# EAGLE board Audio-DAC (EAGLE 9.6.2), part 1 of 2
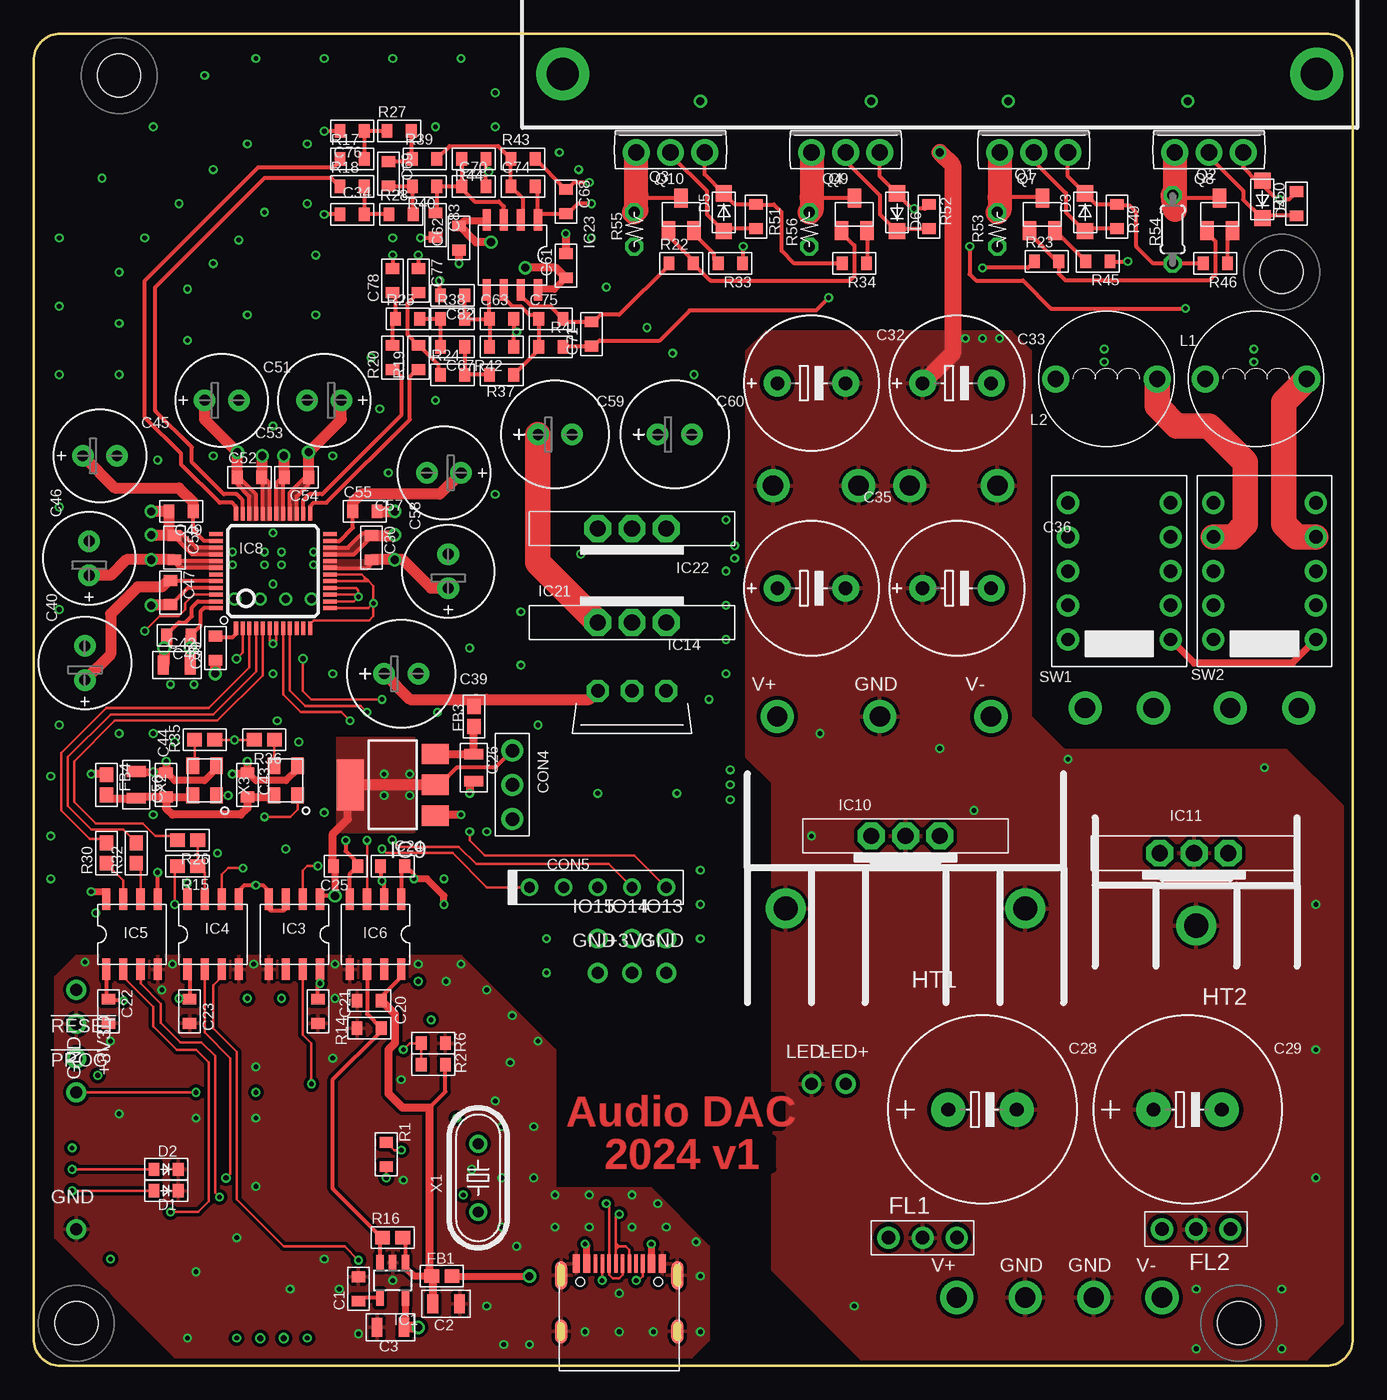
[diagram p3: board, top side]
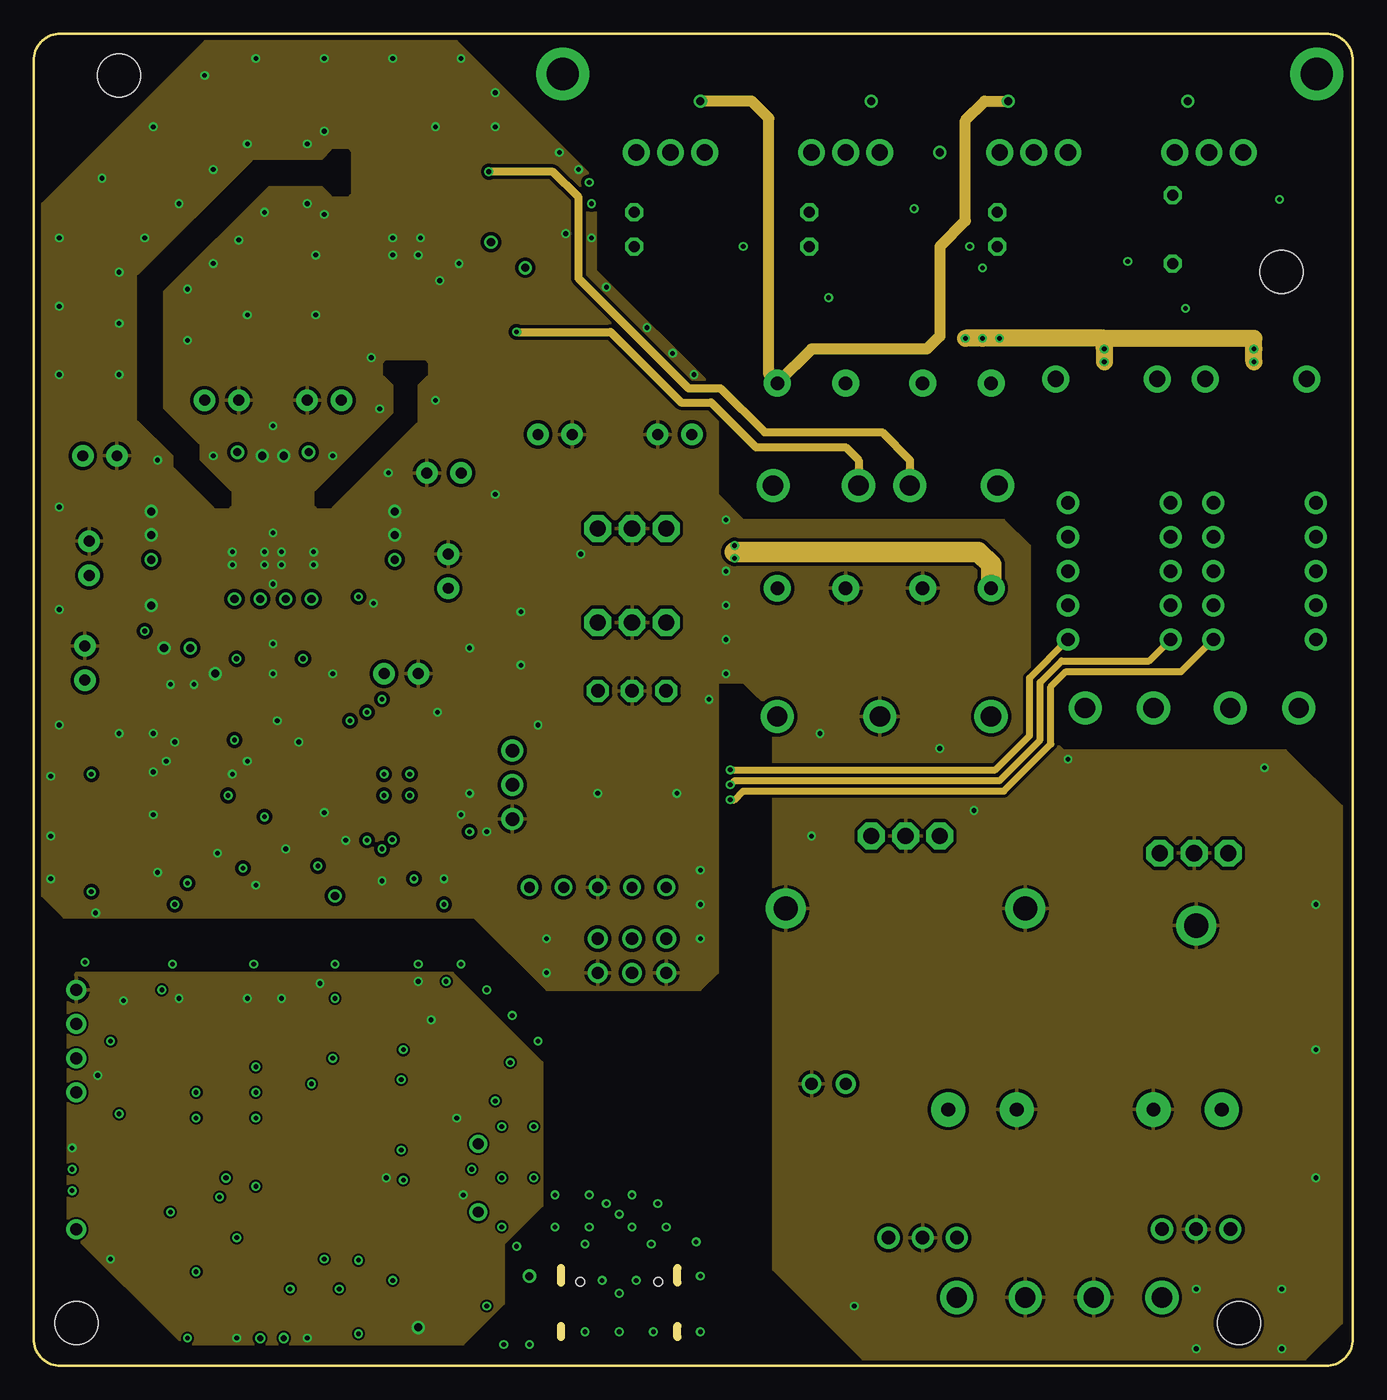
[diagram p4: board, inner layer Route2]
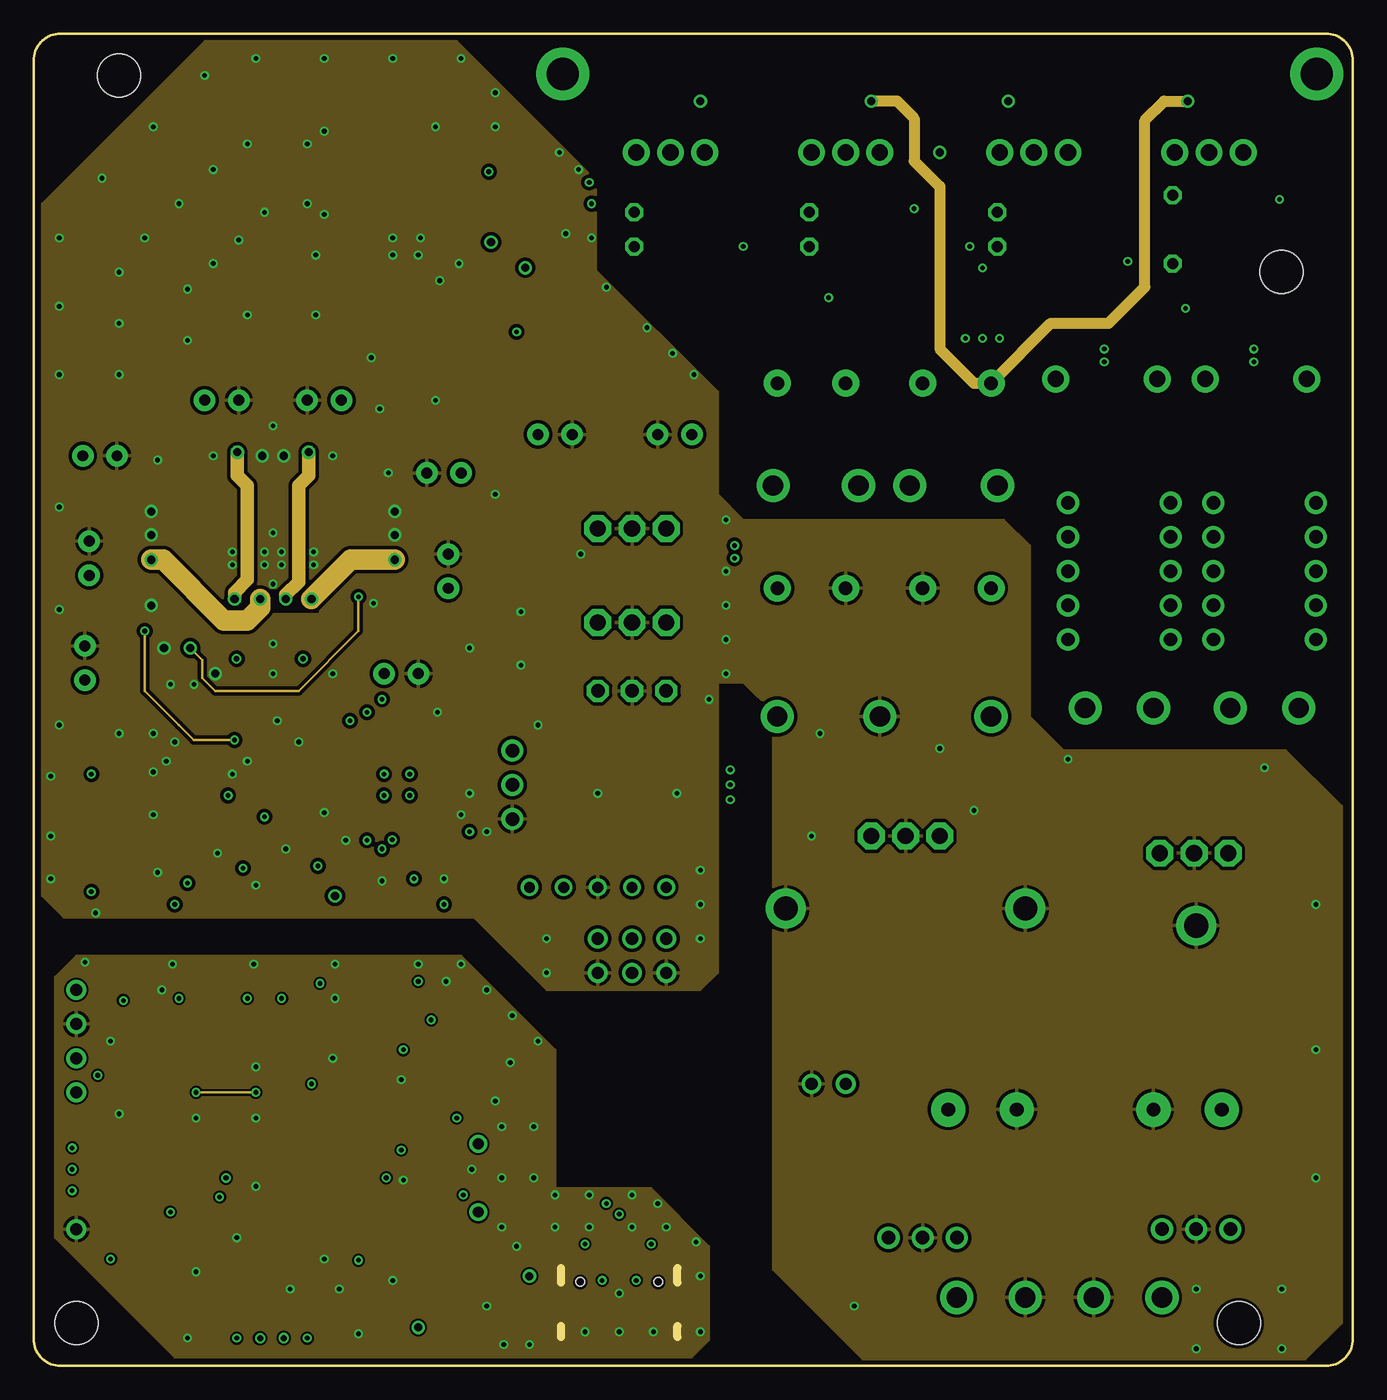
[diagram p5: board, inner layer Route15]
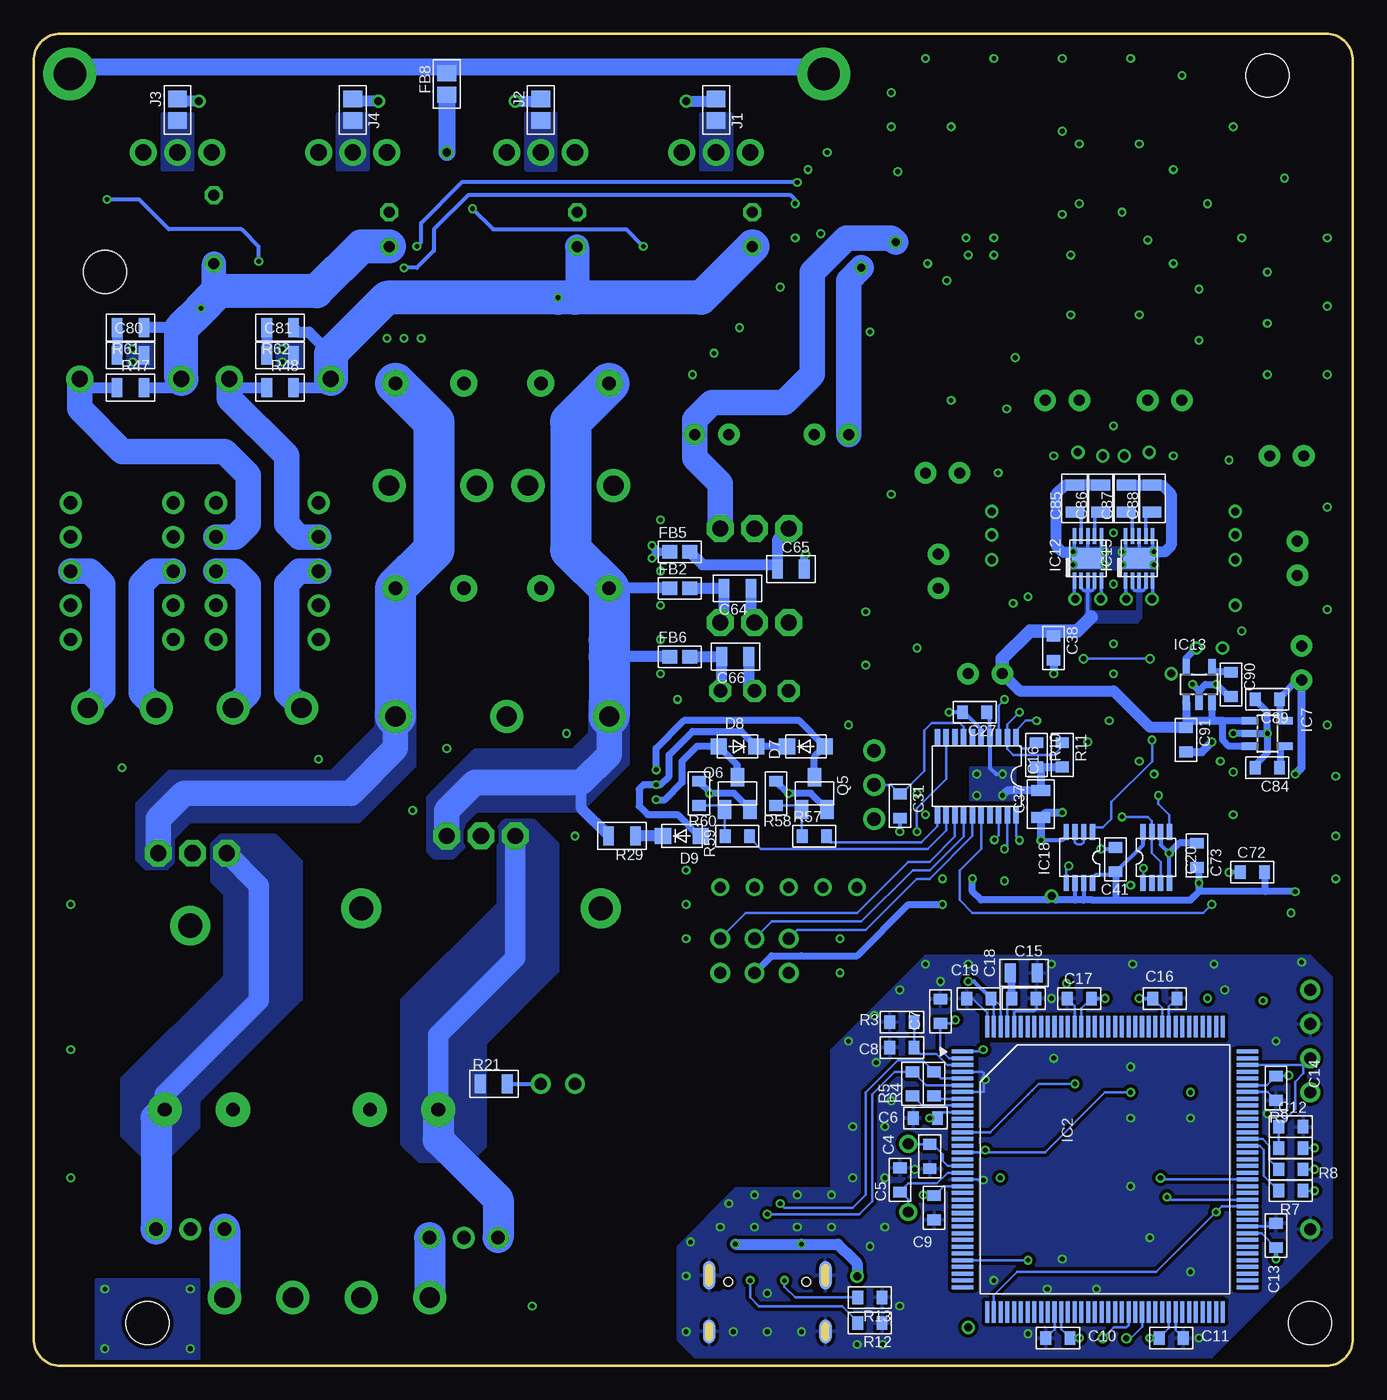
[diagram p6: board, bottom side, seen from below]

Size 98 x 99 mm. Coordinates in mm from the lower left corner, seen from the top.
Outline: 2,0 96,0 arc90 98,2 98,97 arc90 96,99 2,99 arc90 0,97 0,2 arc90 2,0
Copper layers (1*2*15*16): Top 0.035mm / dielectric 0.2mm / Route2 0.0175mm / dielectric 1.065mm / Route15 0.0175mm / dielectric 0.2mm / Bottom 0.035mm
Design rules "JLCPCB_4layer *": minimum track width 6mil, minimum drill 0.3mm, track to track 6mil, track to pad 6mil, pad to pad 6mil, via to via 8mil, smd to smd 0mil, copper to edge 0.2mm, drill to drill 0.4mm, minimum pad ring 8mil, minimum via ring 6mil, stop-mask expansion 4mil, vias tented up to drill 1mm, thermal gap 10mil
tRestrict: 4 lines
bRestrict: 16 lines

## Footprints (pad centres in the part's own frame; a part is rotated, then mirrored left to right if it is on the bottom)
1608C = smd 0.8 x 1: 1 -0.9,0; 2 0.9,0
2012 = smd 0.8 x 1.4: 1 -1,0; 2 1,0
E5-13 = drill 1.016 pad 2.54: + -2.54,0; - 2.54,0
E5-10 = drill 1 pad 2: + -2.54,0; - 2.54,0
E2,5-8 = drill 0.813 pad 1.6: + -1.27,0; - 1.27,0
E2.5-6.5 = drill 0.813 pad 1.6: + -1.27,0; - 1.27,0
5077CR-16-SMC2-BK-TR = smd 0.6 x 1.34: A1,B12:GND -3.2,0.3; A4,B9:VBUS -2.4,0.3; B1,A12:GND 3.2,0.3; B4,A9:VBUS 2.4,0.3 | smd 0.3 x 1.34: A5:CC1 -1.25,0.3; A6:DP1 -0.25,0.3; A7:DN1 0.25,0.3; A8:SBU1 1.25,0.3; B5:CC2 1.75,0.3; B6:DP2 0.75,0.3; B7:DN2 -0.75,0.3; B8:SBU2 -1.75,0.3 | smd 0.9 x 2.1: SHILED1 -4.32,-0.57; SHILED2 4.32,-0.57 | smd 0.9 x 1.8: SHILED3 -4.32,-4.75; SHILED4 4.32,-4.75 | smd 0.9 x 2.1 bottom: SHILED5 -4.32,-0.57; SHILED7 4.32,-0.57 | smd 0.9 x 1.8 bottom: SHILED6 -4.32,-4.75; SHILED8 4.32,-4.75 | hole 0.65: -2.89,-1.07; 2.89,-1.07
VOL_CON = drill 1: 1 -2.54,0; 2 0,0; 3 2.54,0
SWD_CON = drill 0.8: 1 -5.08,0; 2 -2.54,0; 3 0,0; 4 2.54,0; 5 5.08,0
D1608 = smd 0.8 x 1: A 0.9,0; K -0.9,0
SOD123 = smd 1.2 x 1.2: 1 -1.4,0; 2 1.4,0
HOLE_3.2 = hole 3.2: 0,0
HOLE_3.2_CON = hole 3.2: 0,0
1608-J = smd 1.1 x 1: 1 -0.75,0; 2 0.75,0
2012-J = smd 1.2 x 1.4: 1 -0.8,0; 2 0.8,0
FL1 = drill 1 pad 1.6: 1 -2.54,0; 2 0,0; 3 2.54,0
HEATSINK3 = drill 1.8: HT1 -8.9,3; HT2 8.9,3
HEATSINK2 = drill 1.8: HT1 0,3
HEATSINK4 = drill 2.4: HT1 -28,-11; HT2 28,-11
SOT23-5 = smd 0.55 x 1.2: 1 -0.95,-1.3; 2 0,-1.3; 3 0.95,-1.3; 4 0.95,1.3; 5 -0.95,1.3
TQFP144 = smd 0.3 x 1.6: 1 -8.75,-10.6; 2 -8.25,-10.6; 3 -7.75,-10.6; 4 -7.25,-10.6; 5 -6.75,-10.6; 6 -6.25,-10.6; 7 -5.75,-10.6; 8 -5.25,-10.6; 9 -4.75,-10.6; 10 -4.25,-10.6; 11 -3.75,-10.6; 12 -3.25,-10.6; 13 -2.75,-10.6; 14 -2.25,-10.6; 15 -1.75,-10.6; 16 -1.25,-10.6; 17 -0.75,-10.6; 18 -0.25,-10.6; 19 0.25,-10.6; 20 0.75,-10.6; 21 1.25,-10.6; 22 1.75,-10.6; 23 2.25,-10.6; 24 2.75,-10.6; 25 3.25,-10.6; 26 3.75,-10.6; 27 4.25,-10.6; 28 4.75,-10.6; 29 5.25,-10.6; 30 5.75,-10.6; 31 6.25,-10.6; 32 6.75,-10.6; 33 7.25,-10.6; 34 7.75,-10.6; 35 8.25,-10.6; 36 8.75,-10.6; 73 8.75,10.6; 74 8.25,10.6; 75 7.75,10.6; 76 7.25,10.6; 77 6.75,10.6; 78 6.25,10.6; 79 5.75,10.6; 80 5.25,10.6; 81 4.75,10.6; 82 4.25,10.6; 83 3.75,10.6; 84 3.25,10.6; 85 2.75,10.6; 86 2.25,10.6; 87 1.75,10.6; 88 1.25,10.6; 89 0.75,10.6; 90 0.25,10.6; 91 -0.25,10.6; 92 -0.75,10.6; 93 -1.25,10.6; 94 -1.75,10.6; 95 -2.25,10.6; 96 -2.75,10.6; 97 -3.25,10.6; 98 -3.75,10.6; 99 -4.25,10.6; 100 -4.75,10.6; 101 -5.25,10.6; 102 -5.75,10.6; 103 -6.25,10.6; 104 -6.75,10.6; 105 -7.25,10.6; 106 -7.75,10.6; 107 -8.25,10.6; 108 -8.75,10.6 | smd 1.6 x 0.3: 37 10.6,-8.75; 38 10.6,-8.25; 39 10.6,-7.75; 40 10.6,-7.25; 41 10.6,-6.75; 42 10.6,-6.25; 43 10.6,-5.75; 44 10.6,-5.25; 45 10.6,-4.75; 46 10.6,-4.25; 47 10.6,-3.75; 48 10.6,-3.25; 49 10.6,-2.75; 50 10.6,-2.25; 51 10.6,-1.75; 52 10.6,-1.25; 53 10.6,-0.75; 54 10.6,-0.25; 55 10.6,0.25; 56 10.6,0.75; 57 10.6,1.25; 58 10.6,1.75; 59 10.6,2.25; 60 10.6,2.75; 61 10.6,3.25; 62 10.6,3.75; 63 10.6,4.25; 64 10.6,4.75; 65 10.6,5.25; 66 10.6,5.75; 67 10.6,6.25; 68 10.6,6.75; 69 10.6,7.25; 70 10.6,7.75; 71 10.6,8.25; 72 10.6,8.75; 109 -10.6,8.75; 110 -10.6,8.25; 111 -10.6,7.75; 112 -10.6,7.25; 113 -10.6,6.75; 114 -10.6,6.25; 115 -10.6,5.75; 116 -10.6,5.25; 117 -10.6,4.75; 118 -10.6,4.25; 119 -10.6,3.75; 120 -10.6,3.25; 121 -10.6,2.75; 122 -10.6,2.25; 123 -10.6,1.75; 124 -10.6,1.25; 125 -10.6,0.75; 126 -10.6,0.25; 127 -10.6,-0.25; 128 -10.6,-0.75; 129 -10.6,-1.25; 130 -10.6,-1.75; 131 -10.6,-2.25; 132 -10.6,-2.75; 133 -10.6,-3.25; 134 -10.6,-3.75; 135 -10.6,-4.25; 136 -10.6,-4.75; 137 -10.6,-5.25; 138 -10.6,-5.75; 139 -10.6,-6.25; 140 -10.6,-6.75; 141 -10.6,-7.25; 142 -10.6,-7.75; 143 -10.6,-8.25; 144 -10.6,-8.75
SOP8 = smd 0.6 x 1.6: 1 -1.905,-2.6; 2 -0.635,-2.6; 3 0.635,-2.6; 4 1.905,-2.6; 5 1.905,2.6; 6 0.635,2.6; 7 -0.635,2.6; 8 -1.905,2.6
LQFP48 = smd 0.3 x 1: 1 -2.75,-4.25; 2 -2.25,-4.25; 3 -1.75,-4.25; 4 -1.25,-4.25; 5 -0.75,-4.25; 6 -0.25,-4.25; 7 0.25,-4.25; 8 0.75,-4.25; 9 1.25,-4.25; 10 1.75,-4.25; 11 2.25,-4.25; 12 2.75,-4.25; 25 2.75,4.25; 26 2.25,4.25; 27 1.75,4.25; 28 1.25,4.25; 29 0.75,4.25; 30 0.25,4.25; 31 -0.25,4.25; 32 -0.75,4.25; 33 -1.25,4.25; 34 -1.75,4.25; 35 -2.25,4.25; 36 -2.75,4.25 | smd 1 x 0.3: 13 4.25,-2.75; 14 4.25,-2.25; 15 4.25,-1.75; 16 4.25,-1.25; 17 4.25,-0.75; 18 4.25,-0.25; 19 4.25,0.25; 20 4.25,0.75; 21 4.25,1.25; 22 4.25,1.75; 23 4.25,2.25; 24 4.25,2.75; 37 -4.25,2.75; 38 -4.25,2.25; 39 -4.25,1.75; 40 -4.25,1.25; 41 -4.25,0.75; 42 -4.25,0.25; 43 -4.25,-0.25; 44 -4.25,-0.75; 45 -4.25,-1.25; 46 -4.25,-1.75; 47 -4.25,-2.25; 48 -4.25,-2.75
SOT223 = smd 1.5 x 2: 1 -2.3,-3.15; 2 0,-3.15; 3 2.3,-3.15 | smd 3.8 x 2: 4 0,3.15
REGULATOR_LED = drill 1.2 pad 2 octagon: 1 -2.54,0; 2 0,0; 3 2.54,0
PLP10-SMD = smd 0.26 x 1.2: 1 -1,-1.65; 2 -0.5,-1.65; 3 0,-1.65; 4 0.5,-1.65; 5 1,-1.65; 6 1,1.65; 7 0.5,1.65; 8 0,1.65; 9 -0.5,1.65; 10 -1,1.65 | smd 2.4 x 1.5: HT 0,0
TO-220 = drill 1 pad 1.6 octagon: 1 -2.54,0; 2 0,0; 3 2.54,0
TSSOP20 = smd 0.4 x 1.3: 1 -2.925,-2.85; 2 -2.275,-2.85; 3 -1.625,-2.85; 4 -0.975,-2.85; 5 -0.325,-2.85; 6 0.325,-2.85; 7 0.975,-2.85; 8 1.625,-2.85; 9 2.275,-2.85; 10 2.925,-2.85; 11 2.925,2.85; 12 2.275,2.85; 13 1.625,2.85; 14 0.975,2.85; 15 0.325,2.85; 16 -0.325,2.85; 17 -0.975,2.85; 18 -1.625,2.85; 19 -2.275,2.85; 20 -2.925,2.85
SSOP8-P-0.65 = smd 0.4 x 1.2: 1 -0.975,-1.9; 2 -0.325,-1.9; 3 0.325,-1.9; 4 0.975,-1.9; 5 0.975,1.9; 6 0.325,1.9; 7 -0.325,1.9; 8 -0.975,1.9
L7-10-2 = drill 1.2 pad 2: 1 -3.77,0; 2 3.77,0
TO126 = drill 1.2 pad 2: 1 -2.54,0; 2 0,0; 3 2.54,0
SC59 = smd 1 x 1.4: 1 -0.95,-1.2; 2 0.95,-1.2; 3 0,1.2
1608 = smd 0.8 x 1: 1 -0.9,0; 2 0.9,0
0207/2V = drill 0.813 octagon: 1 -1.27,0; 2 1.27,0
0204/5 = drill 0.813 octagon: 1 -2.54,0; 2 2.54,0
EA2 = drill 1: 1 -5.08,3.81; 2 -2.54,3.81; 3 0,3.81; 4 2.54,3.81; 5 5.08,3.81; 6 5.08,-3.81; 7 2.54,-3.81; 8 0,-3.81; 9 -2.54,-3.81; 10 -5.08,-3.81
TESTPIN = drill 0.9 pad 1.4: 1 0,0
TESTPIN-BIG = drill 1.5: 1 0,0
HC49/S = drill 0.813: 1 -2.54,0; 2 2.54,0
KC3225 = smd 1.2 x 0.95: 1 -1.1,-0.875; 2 1.1,-0.875; 3 1.1,0.875; 4 -1.1,0.875

## Placement (x,y rotation side)
C1  0.1u  [1608C]  24.13,5.71 90 top
C2  10u  [2012]  30.64,4.6 0 top
C3  22u  [2012]  26.51,2.86 180 top
C4  10p  [1608C]  31.43,15.56 270 bottom
C5  10p  [1608C]  33.66,13.81 90 bottom
C6  0.1u  [1608C]  31.75,18.41 180 bottom
C7  0.1u  [1608C]  30.64,26.35 90 bottom
C8  10p  [1608C]  33.5,23.65 180 bottom
C9  0.1u  [1608C]  31.11,11.75 90 bottom
C10  0.1u  [1608C]  21.91,2.06 0 bottom
C11  0.1u  [1608C]  13.49,2.06 0 bottom
C12  0.1u  [1608C]  4.6,17.78 0 bottom
C13  0.1u  [1608C]  5.71,9.68 90 bottom
C14  0.1u  [1608C]  5.71,20.64 90 bottom
C15  2.2u  [2012]  24.45,29.21 180 bottom
C16  0.1u  [1608C]  13.97,27.3 180 bottom
C17  0.1u  [1608C]  20.32,27.3 180 bottom
C18  1000p  [1608C]  24.45,27.3 180 bottom
C19  0.1u  [1608C]  27.78,27.3 180 bottom
C20  0.1u  [1608C]  24.92,27.15 180 top
C21  0.1u  [1608C]  21.11,26.35 270 top
C22  0.1u  [1608C]  5.56,26.35 270 top
C23  0.1u  [1608C]  11.59,26.35 270 top
C24  0.1u  [1608C]  26.67,37.15 180 top
C25  0.1u  [1608C]  23.18,37.15 0 top
C26  10u  [2012]  32.7,44.45 270 top
C27  0.1u  [1608C]  28.1,48.58 180 bottom
C28  1000u  [E5-13]  70.48,19.05 0 top
C29  1000u  [E5-13]  85.72,19.05 0 top
C30  0.1u  [1608C]  25.08,60.8 270 top
C31  DNP  [1608C]  33.66,41.59 270 bottom
C32  1000u  [E5-10]  57.78,73.03 0 top
C33  1000u  [E5-10]  68.58,73.03 0 top
C34  3.3n  [1608C]  23.65,85.57 180 top
C35  1000u  [E5-10]  57.78,57.78 0 top
C36  1000u  [E5-10]  68.58,57.78 0 top
C37  10u  [2012]  23.18,41.75 270 bottom
C38  0.1u  [1608C]  22.23,53.34 270 bottom
C39  220u  [E2,5-8]  27.3,51.44 0 top
C40  100u  [E2.5-6.5]  3.81,52.23 90 top
C41  0.1u  [1608C]  17.62,37.62 90 bottom
C42  10u  [2012]  10.64,52.07 180 top
C43  0.1u  [1608C]  15.88,43.18 90 top
C44  0.1u  [1608C]  9.84,43.18 90 top
C45  100u  [E2.5-6.5]  4.92,67.63 0 top
C46  220u  [E2.5-6.5]  4.13,60.01 90 top
C47  0.1u  [1608C]  10.16,57.47 270 top
C48  0.1u  [1608C]  10.79,54.29 180 top
C49  0.1u  [1608C]  10.95,63.5 180 top
C50  0.1u  [1608C]  10.48,60.8 270 top
C51  100u  [E2.5-6.5]  13.97,71.75 0 top
C52  0.1u  [1608C]  16.03,66.04 0 top
C53  100u  [E2.5-6.5]  21.59,71.75 180 top
C54  0.1u  [1608C]  19.53,66.04 180 top
C55  0.1u  [1608C]  24.61,63.5 0 top
C56  10u  [2012]  7.62,43.18 90 top
C57  100u  [E2.5-6.5]  30.48,66.36 180 top
C58  220u  [E2.5-6.5]  30.8,59.05 90 top
C59  100u  [E2,5-8]  38.73,69.22 0 top
C60  100u  [E2,5-8]  47.62,69.22 0 top
C61  0.1u  [1608C]  39.53,81.76 90 top
C62  0.1u  [1608C]  31.59,83.82 90 top
C63  CMP  [1608C]  34.77,77.79 0 top
C64  10u  [2012]  45.72,57.78 0 bottom
C65  10u  [2012]  41.75,59.21 180 bottom
C66  10u  [2012]  45.88,52.7 0 bottom
C67  3.3n  [1608C]  31.11,75.72 180 top
C68  FF  [1608C]  39.53,86.52 270 top
C69  3.3n  [1608C]  26.35,88.58 270 top
C70  CMP  [1608C]  32.7,87.63 0 top
C71  FF  [1608C]  41.43,76.68 90 top
C72  0.1u  [1608C]  7.46,36.67 180 bottom
C73  0.1u  [1608C]  11.59,37.94 90 bottom
C74  CMP  [1608C]  36.35,87.63 0 top
C75  CMP  [1608C]  38.42,77.79 0 top
C76  3.3n  [1608C]  23.65,91.76 0 top
C77  3.3n  [1608C]  28.57,80.64 270 top
C78  3.3n  [1608C]  26.67,80.64 90 top
C79  1u  [1608C]  13.49,53.34 90 top
C80  0.01u  [2012]  90.81,75.09 0 bottom
C81  0.01u  [2012]  79.69,75.09 0 bottom
C82  DNP  [1608C]  31.11,79.53 180 top
C83  DNP  [1608C]  29.84,84.77 270 top
C84  1u  [1608C]  6.35,44.45 180 bottom
C85  10u  [2012]  20.64,64.45 90 bottom
C86  10u  [2012]  18.73,64.45 90 bottom
C87  10u  [2012]  16.83,64.45 90 bottom
C88  10u  [2012]  14.92,64.45 90 bottom
C89  0.1u  [1608C]  6.35,49.53 180 bottom
C90  1u  [1608C]  9.05,50.64 270 bottom
C91  0.1u  [1608C]  12.38,46.51 270 bottom
CON1  USB-C  [5077CR-16-SMC2-BK-TR]  43.5,7.3 0 top
CON4  VOLUEME  [VOL_CON]  35.56,43.18 270 top
CON5  SWD  [SWD_CON]  41.91,35.56 0 top
D1  RED  [D1608]  9.84,13.02 180 top
D2  GREEN  [D1608]  9.84,14.61 180 top
D3  10m  [SOD123]  78.11,85.72 90 top
D4  10m  [SOD123]  91.28,86.68 270 top
D5  10m  [SOD123]  51.28,85.72 90 top
D6  10m  [SOD123]  64.14,85.72 270 top
D7  SBD  [SOD123]  40.64,46.04 180 bottom
D8  SBD  [SOD123]  45.72,46.04 0 bottom
D9  3.9V  [SOD123]  49.85,39.37 180 bottom
DR1  HOLE-3.2  [HOLE_3.2]  3.17,3.17 270 top
DR2  HOLE-3.2  [HOLE_3.2]  6.35,95.89 0 top
DR3  HOLE-3.2-CON  [HOLE_3.2_CON]  89.53,3.17 0 top
DR4  HOLE-3.2  [HOLE_3.2]  92.71,81.28 0 top
FB1  FB  [1608-J]  30.32,6.67 180 top
FB2  FB  [1608-J]  50.01,57.78 0 bottom
FB3  FB  [1608-J]  32.7,48.26 270 top
FB4  FB  [1608-J]  5.4,43.18 270 top
FB5  FB  [1608-J]  50.01,60.48 0 bottom
FB6  FB  [1608-J]  50.01,52.7 0 bottom
FB8  HT  [2012-J]  67.31,95.25 270 bottom
FL1  0.1u  [FL1]  66.04,9.53 0 top
FL2  0.1u  [FL1]  86.36,10.16 180 top
HT1  HEATSINK-3  [HEATSINK3]  64.77,36.99 180 top
HT2  HEATSINK-2  [HEATSINK2]  86.36,35.72 180 top
HT3  HEATSINK-4  [HEATSINK4]  67.31,107 0 top
IC1  3.3V  [SOT23-5]  26.67,6.35 180 top
IC2  AT32UC3A3256  [TQFP144]  18.41,14.61 270 bottom
IC3  SI8420  [SOP8]  19.37,32.07 180 top
IC4  SI8420  [SOP8]  13.34,32.07 0 top
IC5  SI8420  [SOP8]  7.3,32.07 0 top
IC6  SI8420  [SOP8]  25.4,32.07 180 top
IC7  TAR5SB33  [SOT23-5]  6.35,46.99 270 bottom
IC8  AK4493EQ  [LQFP48]  17.78,59.05 0 top
IC9  AZ1086H-3.3  [SOT223]  26.67,43.18 90 top
IC10  +15V  [REGULATOR_LED]  64.77,39.37 180 top
IC11  -15V  [REGULATOR_LED]  86.2,38.1 180 top
IC12  AK1110  [PLP10-SMD]  19.68,60.01 0 bottom
IC13  TAR5SB33  [SOT23-5]  11.43,50.64 0 bottom
IC14  +9V  [TO-220]  44.45,50.16 180 top
IC15  AK1110  [PLP10-SMD]  15.88,60.01 0 bottom
IC16  STM32G031F  [TSSOP20]  27.94,43.81 180 bottom
IC18  TC7WH74FU  [SSOP8-P-0.65]  20.32,37.78 180 bottom
IC20  TC7WU04FU  [SSOP8-P-0.65]  14.61,37.78 0 bottom
IC21  +10V  [REGULATOR_LED]  44.45,55.24 0 top
IC22  -10V  [REGULATOR_LED]  44.45,62.23 180 top
IC23  ADA4075  [SOP8]  35.56,82.55 180 top
J1  V+  [2012-J]  47.31,93.34 90 bottom
J2  V-  [2012-J]  60.33,93.34 270 bottom
J3  V-  [2012-J]  87.31,93.34 270 bottom
J4  V+  [2012-J]  74.3,93.34 90 bottom
L1  1u  [L7-10-2]  90.81,73.34 0 top
L2  1u  [L7-10-2]  79.69,73.34 0 top
Q1  NPN  [TO126]  74.3,90.17 0 top
Q2  PNP  [TO126]  87.31,90.17 0 top
Q3  NPN  [TO126]  47.31,90.17 0 top
Q4  PNP  [TO126]  60.33,90.17 0 top
Q5  NPN  [SC59]  40.01,42.55 0 bottom
Q6  NPN  [SC59]  45.72,42.55 0 bottom
Q7  NPN  [SC59]  74.93,85.57 0 top
Q8  PNP  [SC59]  88.11,85.57 0 top
Q9  PNP  [SC59]  60.96,85.57 0 top
Q10  NPN  [SC59]  48.1,85.57 0 top
R1  10k  [1608]  26.19,15.72 270 top
R2  1.5k  [1608]  29.69,22.38 0 top
R3  6.8k  [1608]  33.5,25.56 0 bottom
R4  39  [1608]  31.11,20.95 270 bottom
R5  39  [1608]  32.7,20.95 270 bottom
R6  10k  [1608]  29.69,23.97 180 top
R7  1.5k  [1608]  4.6,13.02 180 bottom
R8  1.5k  [1608]  4.6,14.61 180 bottom
R9  10k  [1608]  4.6,16.19 0 bottom
R10  10k  [1608]  23.5,45.4 270 bottom
R11  10k  [1608]  21.59,45.4 270 bottom
R12  5k  [1608]  35.88,3.17 180 bottom
R13  5k  [1608]  35.88,5.08 180 bottom
R14  1.5k  [1608]  24.92,25.08 0 top
R15  47  [1608-J]  11.43,37.15 180 top
R16  DNP  [1608-J]  26.67,9.53 0 top
R17  1k  [1608]  23.65,89.69 0 top
R18  1k  [1608]  23.65,87.63 0 top
R19  1k  [1608]  28.57,74.93 90 top
R20  1k  [1608]  26.67,74.93 90 top
R21  10k  [2012]  63.82,20.95 0 bottom
R22  50  [1608]  48.1,81.92 0 top
R23  50  [1608]  75.25,82.07 0 top
R24  1k  [1608]  31.11,73.66 0 top
R25  1k  [1608]  27.78,77.79 0 top
R26  47  [1608-J]  11.43,39.05 180 top
R27  1k  [1608]  27.15,91.76 0 top
R28  1k  [1608]  27.3,85.57 0 top
R29  10  [2012]  54.29,39.37 180 bottom
R30  47  [1608-J]  5.4,38.1 90 top
R32  47  [1608-J]  7.62,38.1 90 top
R33  10  [1608]  51.75,81.92 180 top
R34  10  [1608]  60.96,81.92 180 top
R35  39  [1608-J]  12.7,46.51 0 top
R36  39  [1608-J]  17.14,46.51 180 top
R37  1k  [1608]  34.77,73.66 0 top
R38  1k  [1608]  31.11,77.79 0 top
R39  1k  [1608]  29.05,89.69 0 top
R40  1k  [1608]  29.05,87.63 0 top
R41  1.5k  [1608]  38.42,75.72 0 top
R42  1.5k  [1608]  34.77,75.72 180 top
R43  1.5k  [1608]  36.35,89.69 0 top
R44  1.5k  [1608]  32.7,89.69 180 top
R45  10  [1608]  79.06,82.07 180 top
R46  10  [1608]  87.79,81.92 180 top
R47  10  [2012]  90.81,72.71 180 bottom
R48  10  [2012]  79.69,72.71 180 bottom
R49  10k  [1608]  80.49,85.41 270 top
R50  10k  [1608]  93.82,86.36 90 top
R51  10k  [1608]  53.66,85.41 270 top
R52  10k  [1608]  66.52,85.41 90 top
R53  1  [0207/2V]  71.6,84.45 90 top
R54  1  [0204/5]  84.61,84.45 270 top
R55  1  [0207/2V]  44.61,84.45 90 top
R56  1  [0207/2V]  57.63,84.45 270 top
R57  1.5k  [1608]  40.01,39.37 0 bottom
R58  10k  [1608]  42.86,42.55 270 bottom
R59  1.5k  [1608]  45.72,39.37 0 bottom
R60  10k  [1608]  48.58,42.55 270 bottom
R61  22  [2012]  90.81,77.15 0 bottom
R62  22  [2012]  79.69,77.15 0 bottom
SW1  EA2  [EA2]  80.64,59.05 90 top
SW2  EA2  [EA2]  91.44,59.05 90 top
TP1  !PROG  [TESTPIN]  3.17,20.32 0 top
TP2  !RESET  [TESTPIN]  3.17,22.86 0 top
TP3  GND  [TESTPIN]  3.17,10.16 0 top
TP5  V+  [TESTPIN-BIG]  68.58,5.08 0 top
TP6  GND  [TESTPIN-BIG]  73.66,5.08 0 top
TP7  GND  [TESTPIN-BIG]  78.74,5.08 0 top
TP8  V-  [TESTPIN-BIG]  83.82,5.08 0 top
TP9  IO15  [TESTPIN]  41.91,31.75 0 top
TP10  IO14  [TESTPIN]  44.45,31.75 0 top
TP11  V+  [TESTPIN-BIG]  55.24,48.26 0 top
TP12  IO13  [TESTPIN]  46.99,31.75 0 top
TP13  GND  [TESTPIN]  46.99,29.21 0 top
TP14  GND  [TESTPIN]  41.91,29.21 0 top
TP15  LED+  [TESTPIN]  60.33,20.95 0 top
TP16  LED-  [TESTPIN]  57.78,20.95 0 top
TP17  +3V3  [TESTPIN]  44.45,29.21 0 top
TP21  V-  [TESTPIN-BIG]  71.12,48.26 0 top
TP22  GND  [TESTPIN-BIG]  62.87,48.26 0 top
TP25  GND  [TESTPIN]  3.17,25.4 0 top
TP26  +3V3D  [TESTPIN]  3.17,27.94 0 top
TP27  GND_L  [TESTPIN-BIG]  71.6,65.41 90 top
TP28  SPK_L  [TESTPIN-BIG]  83.19,48.9 0 top
TP29  SPK_R  [TESTPIN-BIG]  78.11,48.9 0 top
TP30  GND_R  [TESTPIN-BIG]  54.93,65.41 0 top
TP31  GND  [TESTPIN-BIG]  65.09,65.41 0 top
TP32  HP_L  [TESTPIN-BIG]  93.98,48.9 0 top
TP33  HP_R  [TESTPIN-BIG]  88.9,48.9 0 top
TP34  GND_R  [TESTPIN-BIG]  61.28,65.41 0 top
X1  12MHz  [HC49/S]  33.02,13.97 90 top
X2  24.576MHz  [KC3225]  12.7,43.5 90 top
X3  22.5792MHz  [KC3225]  18.73,43.5 90 top